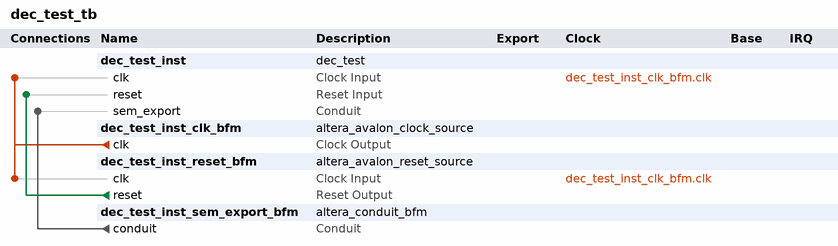
[diagram p0: system contents]
# Platform Designer (Qsys) system dec_test_tb, Cyclone IV E EP4CE115F29C7
# Parameters at their usual value, and those the tool derives, are not listed.
package require -exact qsys 18.1
create_system dec_test_tb
set_project_property DEVICE_FAMILY {Cyclone IV E}
set_project_property DEVICE EP4CE115F29C7

add_instance dec_test_inst dec_test 1.0

add_instance dec_test_inst_clk_bfm altera_avalon_clock_source 18.1

add_instance dec_test_inst_reset_bfm altera_avalon_reset_source 18.1
set_instance_parameter_value dec_test_inst_reset_bfm ASSERT_HIGH_RESET 0
set_instance_parameter_value dec_test_inst_reset_bfm INITIAL_RESET_CYCLES 50

add_instance dec_test_inst_sem_export_bfm altera_conduit_bfm 18.1
set_instance_parameter_value dec_test_inst_sem_export_bfm CLOCKED_SIGNAL false
set_instance_parameter_value dec_test_inst_sem_export_bfm ENABLE_RESET false
set_instance_parameter_value dec_test_inst_sem_export_bfm SIGNAL_DIRECTIONS input,input,output,input
set_instance_parameter_value dec_test_inst_sem_export_bfm SIGNAL_ROLES green,red,train,yellow
set_instance_parameter_value dec_test_inst_sem_export_bfm SIGNAL_WIDTHS 1,1,1,1

# connections
add_connection dec_test_inst_clk_bfm.clk dec_test_inst.clk clock
add_connection dec_test_inst_clk_bfm.clk dec_test_inst_reset_bfm.clk clock
add_connection dec_test_inst_reset_bfm.reset dec_test_inst.reset reset
add_connection dec_test_inst_sem_export_bfm.conduit dec_test_inst.sem_export conduit

set_interconnect_requirement {$system} qsys_mm.clockCrossingAdapter HANDSHAKE
set_interconnect_requirement {$system} qsys_mm.enableEccProtection FALSE
set_interconnect_requirement {$system} qsys_mm.insertDefaultSlave FALSE
set_interconnect_requirement {$system} qsys_mm.maxAdditionalLatency 1

save_system dec_test_tb.qsys
